# EasyEDA Pro project [Flatfish]_DevBoard.epro, schematic Schematic
Board Name: Board1; Create Date: 2025-02-04; Page Name: P1; Project Name: [Flatfish]; Schematic Name: Schematic; Update Date: 2025-02-23; Company: 嘉立创EDA; Drawed: 晚寒; Page Size: A4; Reviewed: 晚寒; Version: V1.0
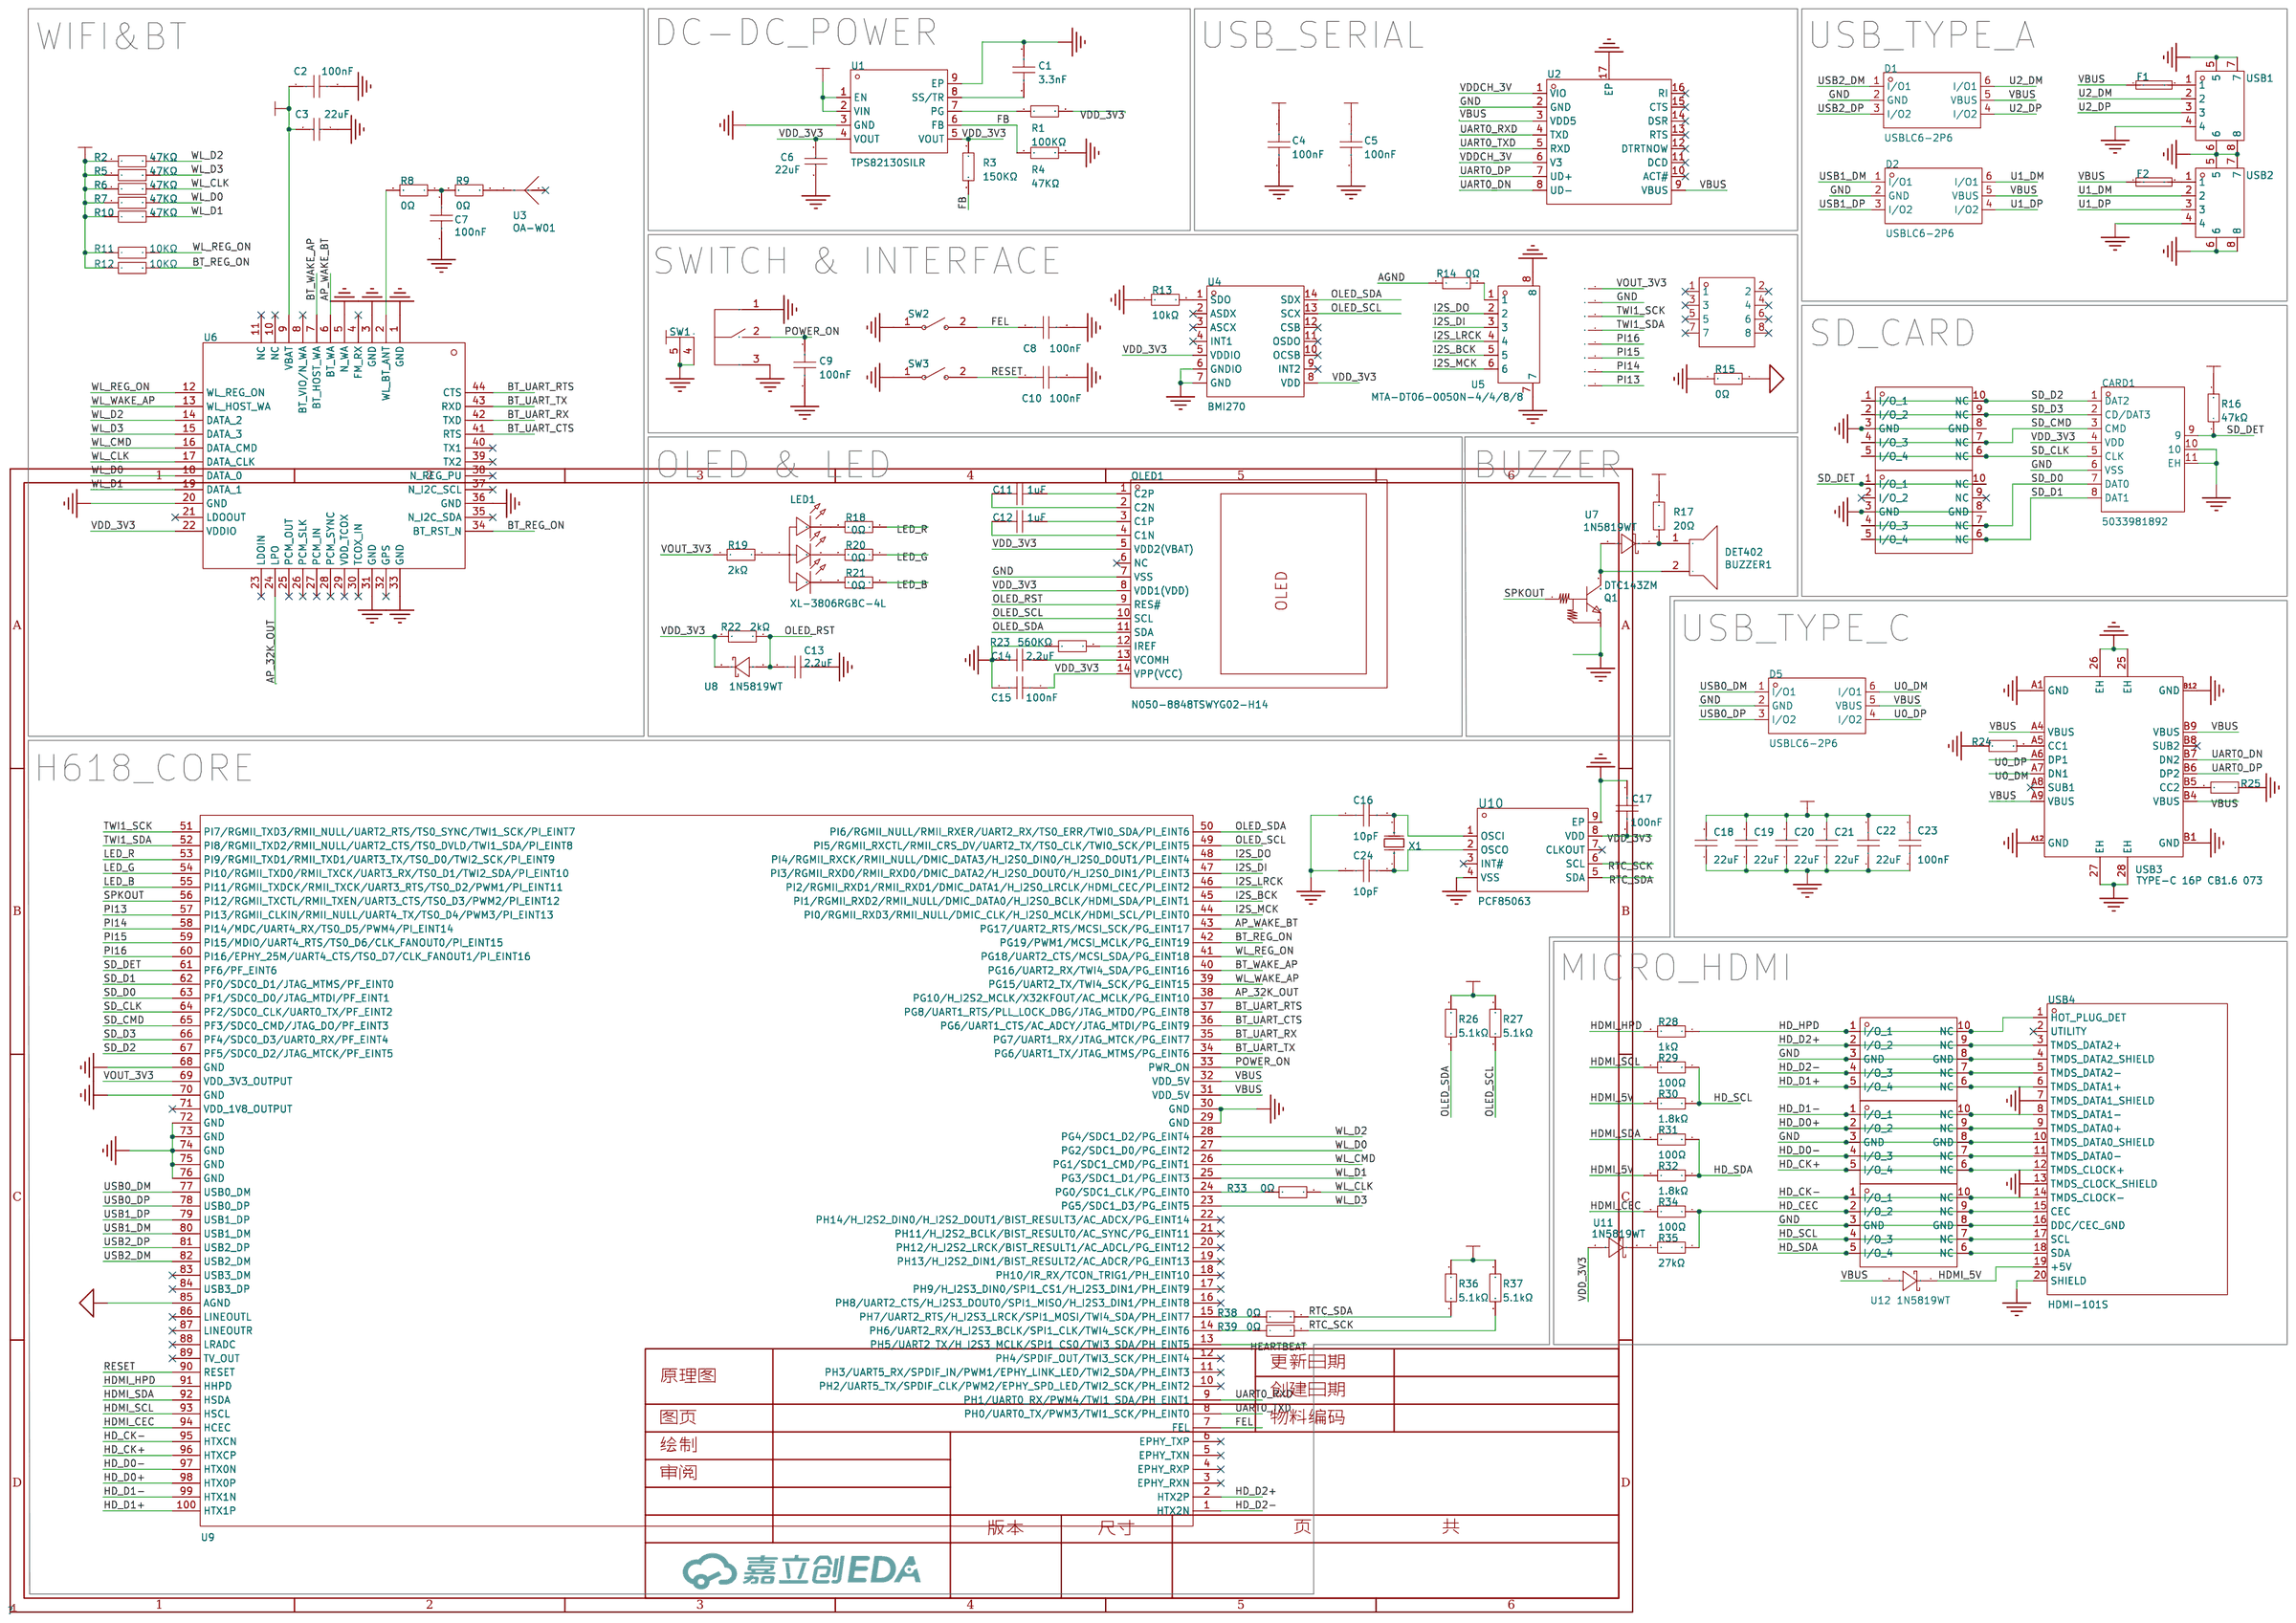
[diagram p0: schematic sheet]

## Parts
BUZZER1  DET402  [BUZ-SMD_L4.0-W3.0-LS4.5-FD]
C1  3.3nF  [C0402-NSK]
C2  100nF  [C0402-NSK]
C3  22uF  [C0603 NSK]
C4  100nF  [C0402-NSK]
C5  100nF  [C0402-NSK]
C6  22uF  [C0603 NSK]
C7  100nF  [C0402-NSK]
C8  100nF  [C0402-NSK]
C9  100nF  [C0402-NSK]
C10  100nF  [C0402-NSK]
C11  1uF  [C0402-NSK]
C12  1uF  [C0402-NSK]
C13  2.2uF  [C0402-NSK]
C14  2.2uF  [C0402-NSK]
C15  100nF  [C0402-NSK]
C16  10pF  [C0402-NSK]
C17  100nF  [C0402-NSK]
C18  22uF  [C0603 NSK]
C19  22uF  [C0603 NSK]
C20  22uF  [C0603 NSK]
C21  22uF  [C0603 NSK]
C22  22uF  [C0402-NSK]
C23  100nF  [C0402-NSK]
C24  10pF  [C0402-NSK]
CARD1  5033981892  [TF-SMD_503398-1892]
D1  USBLC6-2P6  [SOT-666-6_L1.6-W1.2-P0.50-LS1.6-BL]
D2  USBLC6-2P6  [SOT-666-6_L1.6-W1.2-P0.50-LS1.6-BL]
D3  ESD73034D  [DFN2510-10_L2.5-W1.0-P0.50-BL]
D4  ESD73034D  [DFN2510-10_L2.5-W1.0-P0.50-BL]
D5  USBLC6-2P6  [SOT-666-6_L1.6-W1.2-P0.50-LS1.6-BL]
D6  ESD73034D  [DFN2510-10_L2.5-W1.0-P0.50-BL]
D7  ESD73034D  [DFN2510-10_L2.5-W1.0-P0.50-BL]
D8  ESD73034D  [DFN2510-10_L2.5-W1.0-P0.50-BL]
F1  0603L035/16XR  [F0603]
F2  0603L035/16XR  [F0603]
H1  圆形焊盘  [圆形焊盘]
H2  B254YP-ZS04P  [HDR-TH_8P-P2.54-V-F-R2-C5-S2.54_5-534206-4]
H3  圆形焊盘  [圆形焊盘]
H4  圆形焊盘  [圆形焊盘]
H5  圆形焊盘  [圆形焊盘]
H6  圆形焊盘  [圆形焊盘]
H7  圆形焊盘  [圆形焊盘]
H8  圆形焊盘  [圆形焊盘]
H9  圆形焊盘  [圆形焊盘]
LED1  XL-3806RGBC-4L  [LED-SMD_4P-L3.8-W1.0_XL-3806RGBC-4L]
OLED1  N050-8848TSWYG02-H14  [OLED-SMD_N050-8848TSWYG02-H14]
Q1  DTC143ZM  [SOT-723-3_L1.2-W0.8-P0.80-LS1.2-BR]
R1  100KΩ  [R0402]
R2  47KΩ  [R0402]
R3  150KΩ  [R0402]
R4  47KΩ  [R0402]
R5  47KΩ  [R0402]
R6  47KΩ  [R0402]
R7  47KΩ  [R0402]
R8  0Ω  [R0402]
R9  0Ω  [R0402]
R10  47KΩ  [R0402]
R11  10KΩ  [R0402]
R12  10KΩ  [R0402]
R13  10kΩ  [R0402]
R14  0Ω  [R0402]
R15  0Ω  [R0402]
R16  47kΩ  [R0402]
R17  20Ω  [R0402]
R18  0Ω  [R0402]
R19  2kΩ  [R0402]
R20  0Ω  [R0402]
R21  0Ω  [R0402]
R22  2kΩ  [R0402]
R23  560KΩ  [R0402]
R24  5.1KΩ  [R0402]
R25  5.1KΩ  [R0402]
R26  5.1kΩ  [R0402]
R27  5.1kΩ  [R0402]
R28  1kΩ  [R0402]
R29  100Ω  [R0402]
R30  1.8kΩ  [R0402]
R31  100Ω  [R0402]
R32  1.8kΩ  [R0402]
R33  0Ω  [R0402]
R34  100Ω  [R0402]
R35  27kΩ  [R0402]
R36  5.1kΩ  [R0402]
R37  5.1kΩ  [R0402]
R38  0Ω  [R0402]
R39  0Ω  [R0402]
SW1  EVPAEBB2A  [KEY-SMD_EVPAEBB2A]
SW2  SW_3*4*2MM  [SW-SMD_L3.9-W2.9-LS4.9-L]
SW3  SW_3*4*2MM  [SW-SMD_L3.9-W2.9-LS4.9-L]
U1  TPS82130SILR  [USIP-8_L3.0-W2.8-P0.65-TL-EP]
U2  -  [QFN-16_L3.0-W3.0-P0.50-TL-EP1.9]
U3  OA-W01  [ANT-SMD_L8.0-W3.0_A]
U4  BMI270  [LGA-14_L3.0-W2.5-P0.50-BR]
U5  MTA-DT06-0050N-4/4/8/8  [FFC-SMD_6P-P0.50_FH34SRJ-6S-0.5SH]
U6  -  [AW869-A]
U7  1N5819WT  [SOD-523_L1.2-W0.8-LS1.6-RD]
U8  1N5819WT  [SOD-523_L1.2-W0.8-LS1.6-RD]
U9  -  [DS-H618-CORE]
U10  PCF85063  [VSON-8_L2.0-W3.0-P0.50-BL-EP]
U11  1N5819WT  [SOD-523_L1.2-W0.8-LS1.6-RD]
U12  1N5819WT  [SOD-523_L1.2-W0.8-LS1.6-RD]
USB1  HX 8.5 CB1.9ZB  [MICRO-USB-SMD_HX-8.5-CB1.9ZB]
USB2  HX 8.5 CB1.9ZB  [MICRO-USB-SMD_HX-8.5-CB1.9ZB]
USB3  TYPE-C 16P CB1.6 073  [USB-C-SMD_SHOU_TYPE-C-16P-CB1.6]
USB4  HDMI-101S  [HDMI-SMD_HDMI-101S]
X1  32.768kHz  [OSC-SMD_L2.0-W1.2]

## Library data of the parts
BUZZER1 = DET402: Supplier Part: C2911630; Supplier Footprint: SMD; Supplier: LCSC
C1 C2 C4 C5 C7-C10 C16 C17 C22-C24 = CC0402FRNPO9BN100: 容值:10pF;精度:±1%;额定电压:50V;材质(温度系数):NP0;; LCSC Part Name: 10pF ±1% 50V; Supplier Part: C513681; Manufacturer: YAGEO(国巨); Supplier Footprint: 0402; JLCPCB Part Class: 扩展库; Datasheet: https://atta.szlcsc.com/upload/public/pdf/source/20200415/C513681_5027FF1861A780E76D33CC24CC34CA99.pdf; Supplier: LCSC; Tolerance: ±1%; Voltage Rated: 50V; Temperature Coefficient: NP0
C3 C6 C18-C21 = CC0603JRNPO9BN120: 容值:12pF;精度:±5%;额定电压:50V;材质(温度系数):NP0;; LCSC Part Name: 12pF ±5% 50V; Supplier Part: C107034; Manufacturer: YAGEO(国巨); Supplier Footprint: 0603; JLCPCB Part Class: 扩展库; Datasheet: https://atta.szlcsc.com/upload/public/pdf/source/20170420/1492670686468.pdf; Supplier: LCSC; Tolerance: ±5%; Voltage Rated: 50V; Temperature Coefficient: NP0
C11-C15 = C0402C0G150J500NTB: 容值:15pF;精度:±5%;额定电压:50V;材质(温度系数):C0G;; LCSC Part Name: 15pF ±5% 50V; Supplier Part: C115610; Manufacturer: EYANG(宇阳科技); Supplier Footprint: 0402; JLCPCB Part Class: 扩展库; Datasheet: https://atta.szlcsc.com/upload/public/pdf/source/20170616/1497588084732.pdf; Supplier: LCSC; Tolerance: ±5%; Voltage Rated: 50V; Temperature Coefficient: C0G
CARD1 = 503398-1892: 卡连接方式:自弹式;卡类型:MicroSD卡(TF卡);连接器类型:卡座;本体最大高度:-;工作温度范围:-25℃~+85℃;; LCSC Part Name: 自弹式 MicroSD卡(TF卡) 卡座; Supplier Part: C428492; Manufacturer: MOLEX; Supplier Footprint: SMD; JLCPCB Part Class: 扩展库; Datasheet: https://atta.szlcsc.com/upload/public/pdf/source/20190912/C428492_A41EF83BB8A3DB8C0B39EF65DFC54013.pdf; Supplier: LCSC; Card Connection Mode: 自弹式; Card Type: MicroSD卡(TF卡); Connector Type: 卡座; Operating Temperature Range: -25℃~+85℃
D1 D2 D5 = USBLC6-2P6_C2827693: 极性：Unidirectional 反向关断电压（典型值）：5.25V 击穿电压（最小值）：6V 箝位电压：17V 峰值脉冲电流（10/1000us）：4A 二极管阵列 TVS USB2 二极管类型: 单向TVS 钳位电压 最大: 17V 二极管封装形式: SOT-666; Supplier: LCSC; Supplier Part: C2827693; Manufacturer: TECH PUBLIC(台舟); JLCPCB Part Class: 扩展库; LCSC Part Name: MSL=3; Supplier Footprint: SOT-666-6; Datasheet: https://atta.szlcsc.com/upload/public/pdf/source/20210810/36353A9194EA9F4E33F8AE18BE051AEA.pdf; Type: ESD
D3 D4 D6-D8 = ESD73034D: 极性:双向;反向截止电压(Vrwm):3.3V;最大钳位电压:18V;峰值脉冲电流(Ipp):3A;峰值脉冲功率(Ppp):60W;击穿电压:6V;; LCSC Part Name: ESD73034D-10/TR; Supplier Part: C7202962; Manufacturer: TECH PUBLIC(台舟); Supplier Footprint: DFN2510-10; JLCPCB Part Class: 扩展库; Datasheet: https://atta.szlcsc.com/upload/public/pdf/source/20230621/0470D2674DE9F15BF57259AF0534F99C.pdf; Supplier: LCSC; polarity: 双向; Reverse Stand-Off Voltage (Vrwm): 3.3V; Maximum Clamping Voltage: 18V; Peak Pulse Current (Ipp): 3A; Peak Pulse Power Dissipation (Ppp): 60W; Breakdown Voltage: 6V; Reverse Leakage Current (Ir): 200nA; Number of Lines: 四路; Type: ESD
F1 F2 = 0603L035/16XR: 耐压:16V;最大电流:40A;保持电流(Ih):350mA;跳闸电流:750mA;; LCSC Part Name: 16V 350mA 0603自恢复; Supplier Part: C7496628; Manufacturer: LUTE(陆特); Supplier Footprint: 0603; JLCPCB Part Class: 扩展库; Datasheet: https://atta.szlcsc.com/upload/public/pdf/source/20230807/696632CDD396EBD91087F7A9C6D2528B.pdf; Supplier: LCSC; Voltage - Max: 16V; Current - Max: 40A; Hold Current: 350mA; Trip Current: 750mA; Power Dissipation: 500mW; Resistance - Initial (Ri) (Min): 200mΩ; Resistance - Post Trip (R1) (Max): 1.4Ω; Time to Trip(Max): 100ms; Operating Temperature: -40℃~+85℃
H1 H3-H9 = 圆形焊盘: _: undefined; Supplier: 无
H2 = B254YP-ZS04P: 插孔结构:2x4P;脚间距:2.54mm;行距:2.54mm;圆孔/方孔:方孔;安装方式:直插;排数:双排;总孔位数:8P;额定电流:3A;插孔方向:顶部;塑高:8.5mm;工作温度:-40℃~+105℃;; LCSC Part Name: 排母 间距：2.54mm 2x4P 直插 方孔; Supplier Part: C41413865; Manufacturer: BXCONN(宝讯); Supplier Footprint: 插件,P=2.54mm; JLCPCB Part Class: 扩展库; Datasheet: https://atta.szlcsc.com/upload/public/pdf/source/20240923/C30EAA82432F541EFEF0DFB626076548.pdf; Supplier: LCSC; Holes Structure: 2x4P; Pitch: 2.54mm; Row Spacing: 2.54mm; Circular Hole / Square Hole: 方孔; Mounting Type: 直插; Number of Rows: 双排; Number of Positions: 8P; Current Rating: 3A; Holes Direction: 顶部; Insulation Height: 8.5mm; Operating Temperature: -40℃~+105℃
LED1 = XL-3806RGBC-4L: 020七彩四脚贴片LED灯珠 3806侧贴RGB; Supplier Part: C2843779; Manufacturer: XINGLIGHT(成兴光); Supplier Footprint: SMD,1x3.8mm; Datasheet: https://atta.szlcsc.com/upload/public/pdf/source/20240218/51067B99556A1A02DEC15823CF43ECFF.pdf; Supplier: LCSC
OLED1 = N050-8848TSWYG02-H14: 主控芯片:CH1115;尺寸(inch):0.5;; LCSC Part Name: 0.50寸 白光 88x48像素分辨率 14PIN; Supplier Part: C2890604; Manufacturer: Newvision(新智景); JLCPCB Part Class: 扩展库; Supplier: LCSC; Main Control Chip: CH1115; Size: 0.5
Q1 = DTC123YM: Supplier Part: C2991958; Manufacturer: CJ(江苏长电/长晶); Supplier Footprint: SOT-723-3; Datasheet: https://atta.szlcsc.com/upload/public/pdf/source/20220411/A4A2C6051A8C92828AF28D7E9AAF91CA.pdf; Supplier: LCSC
R1-R7 R10-R12 R14 R15 R17 R23 = 0402WGF2200TCE: 电阻类型:厚膜电阻;阻值:220Ω;精度:±1%;功率:62.5mW;温度系数:±100ppm/℃;最大工作电压:50V;工作温度范围:-55℃~+155℃;; LCSC Part Name: 220Ω ±1% 62.5mW; Supplier Part: C25091; Manufacturer: UNI-ROYAL(厚声); Supplier Footprint: 0402; JLCPCB Part Class: 基础库; Datasheet: https://atta.szlcsc.com/upload/public/pdf/source/20200306/C422600_1E6D84923E4A46A82E41ADD87F860B5C.pdf; Supplier: LCSC; Type: 厚膜电阻; Tolerance: ±1%; Power(Watts): 62.5mW; Temperature Coefficient: ±100ppm/℃; Overload Voltage (Max): 50V; Operating Temperature Range: -55℃~+155℃
R8 R9 R13 R16 R18-R22 R24-R39 = 0402WGF2402TCE: 电阻类型:厚膜电阻;阻值:24kΩ;精度:±1%;功率:62.5mW;; LCSC Part Name: 24kΩ ±1% 62.5mW; Supplier Part: C25769; Manufacturer: UNI-ROYAL(厚声); Supplier Footprint: 0402; JLCPCB Part Class: 基础库; Datasheet: https://atta.szlcsc.com/upload/public/pdf/source/20200306/C422600_1E6D84923E4A46A82E41ADD87F860B5C.pdf; Supplier: LCSC; Type: 厚膜电阻; Tolerance: ±1%; Power(Watts): 62.5mW; Temperature Coefficient: ±100ppm/℃; Overload Voltage (Max): 50V; Operating Temperature Range: -55℃~+155℃
SW1 = EVPAEBB2A: 电路结构:单刀单掷;按钮形状:矩形按钮;作用力:1.6N;安装方式:立贴;开关长度:4.5mm;开关宽度:2.6mm;开关高度:2.9mm;触点电流:20mA;额定电压(AC):-;额定电压(DC):15V;绝缘电阻:100MΩ;带灯:-;机械寿命:20万次;; LCSC Part Name: 4.5*2.6*2.9mm 立贴 轻触开关; Supplier Part: C79149; Manufacturer: PANASONIC(松下); Supplier Footprint: SMD,2.6x4.5mm; JLCPCB Part Class: 扩展库; Datasheet: https://atta.szlcsc.com/upload/public/pdf/source/20160718/1468827514287.pdf; Supplier: LCSC; Circuit: 单刀单掷; Actuator Style: 矩形按钮; Operating Force: 1.6N; Mounting Style: 立贴; Switch Length: 4.5mm; Switch Width: 2.6mm; Switch Height: 2.9mm; Contact Current: 20mA; Voltage Rating (DC): 15V; Insulation Resistance: 100MΩ; Mechanical Life: 20万次; Operating Temperature: -40℃~+85℃
SW2 SW3 = SW_3*4*2MM: Supplier Part: C9900016193; Supplier Footprint: SW_3*4*2; Supplier: LCSC
U1 = TPS82130SILR: TPS82130 TPS82130 具有集成电感的 3A 17V 降压转换器; Supplier Part: C473914; Manufacturer: TI(德州仪器); Supplier Footprint: USIP-8; JLCPCB Part Class: 扩展库; Datasheet: https://www.ti.com/cn/lit/gpn/tps82130; Supplier: LCSC
U2 = CH343P
U3 = OA-W01: Supplier Part: C9900013136; Supplier Footprint: ANT_OA-W01; JLCPCB Part Class: 扩展库; Supplier: LCSC
U4 = BMI270: 传感器类型:加速度计陀螺仪;; Supplier Part: C2836813; Manufacturer: Bosch(博世); Supplier Footprint: LGA-14(2.5x3); JLCPCB Part Class: 扩展库; Datasheet: https://atta.szlcsc.com/upload/public/pdf/source/20210625/C2836813_35E1F3F92097F45A3828DF13DDBA01A5.pdf; Supplier: LCSC; Sensor Type: 加速度计陀螺仪; Operating Temperature: -40℃~+85℃
U5 = MTA-DT06-0050N-4/4/8/8: Supplier Part: C41407921; Manufacturer: MINTRON(明硕); Supplier Footprint: P=0.5mm; Datasheet: https://atta.szlcsc.com/upload/public/pdf/source/20240914/4DC2B6334F7371956C0E6717EE373EF6.pdf; Supplier: LCSC
U6 = AW869-A
U7 U8 U11 U12 = 1N5819WT_C5185918: Supplier Part: C5185918; Manufacturer: Slkor(萨科微); Supplier Footprint: SOD-523; JLCPCB Part Class: 扩展库; Datasheet: https://atta.szlcsc.com/upload/public/pdf/source/20221009/97BA7A7C41FA3EE01B3D72EDF2EE8067.pdf; Supplier: LCSC
U9 = DS-H618核心板
U10 = PCF85063TP/1Z: Supplier Part: C126170; Manufacturer: NXP(恩智浦); Supplier Footprint: VSON-8-EP(2x3); JLCPCB Part Class: 扩展库; Datasheet: https://atta.szlcsc.com/upload/public/pdf/source/20191129/C126170_981191297460F7359CEAC0EA84BD6628.pdf; Supplier: LCSC; Supply Voltage: 900mV~5.5V; Input Low Voltage: 0V~1.65V; Intput High Voltage: 0.63V~5.5V; Output Low Voltage: 0V~1.1V; Output High Voltage: 0.72V~5.5V; Operating Temperatue: -40℃~+85℃
USB1 USB2 = HX 8.5 CB1.9ZB: 连接器类型:Type-A;标准:USB 2.0;公母:母;安装方式:沉板;触点数量:4P;端口数量:1;额定电流 - 电源:1.5A;工作温度范围:-40℃~+85℃;; Supplier Part: C19189118; Manufacturer: hanxia(韩下); Supplier Footprint: SMD; JLCPCB Part Class: 扩展库; Datasheet: https://atta.szlcsc.com/upload/public/pdf/source/20231103/D03B213206816A0CE5C9ECA2B10CD46F.pdf; Supplier: LCSC; Connector Type: Type-A; Standard: USB 2.0; Gender: 母; Mounting Style: 沉板; Number of Contacts: 4P; Number of Ports: 1; Current Rating - Power (Max): 1.5A; Operating Temperature Range: -40℃~+85℃
USB3 = TYPE-C 16P CB1.6 073: 连接器类型:Type-C;标准:-;公母:母;端口数量:1;触点数量:16P;安装方式:沉板;额定电流 - 电源:3A;工作温度范围:-25℃~+85℃;; LCSC Part Name: Type-C 母 沉板; Supplier Part: C2906290; Manufacturer: SHOU HAN(首韩); Supplier Footprint: SMD; JLCPCB Part Class: 扩展库; Datasheet: https://atta.szlcsc.com/upload/public/pdf/source/20211021/35D048B933FA988260DD32545575C1A5.pdf; Supplier: LCSC; Connector Type: Type-C; Gender: 母; Number of Ports: 1; Number of Contacts: 16P; Mounting Style: 沉板; Current Rating - Power (Max): 3A; Operating Temperature Range: -25℃~+85℃
USB4 = HDMI-101S: 连接器类型:HDMI;公母:母;总PIN位数:19P;安装方式:卧贴;排数:2;额定电流:500mA;触头材质:-;触头镀层:-;工作温度范围:-45℃~+85℃;; LCSC Part Name: HDMI 母 P数:19P; Supplier Part: C720620; Manufacturer: XUNPU(讯普); Supplier Footprint: SMD; JLCPCB Part Class: 扩展库; Datasheet: https://atta.szlcsc.com/upload/public/pdf/source/20221020/616DAE1EB19486B3E4252E4542EF441F.pdf; Supplier: LCSC; Connector Type: HDMI; Gender: 母; Number of Pins: 19P; Mounting Style: 卧贴; Number of Rows: 2; Current Rating (Max): 500mA; Operating Temperature Range: -45℃~+85℃
X1 = X201232768KJD2SI: 晶振类型:贴片晶振;频率:32.768kHz;常温频差:±20ppm;外接负载电容:7pF;频率稳定度(全温):±30ppm;; LCSC Part Name: 32.768kHz ±20ppm 7pF; Supplier Part: C383843; Manufacturer: YXC(扬兴晶振); Supplier Footprint: SMD2012-2P; Datasheet: https://atta.szlcsc.com/upload/public/pdf/source/20240329/EAF6156B280A4D2FB21BB6AE3B6FE94A.pdf; Supplier: LCSC; Crystal Type: 贴片晶振; Normal temperature Frequency Tolerance: ±20ppm; External load capacitor: 7pF; Frequency Stability(Full temperature range): ±30ppm; Operating Temperature: -40℃~+85℃

## Nets
AGND: R14.1 R15.2 U9.85(AGND)
GND: C1.1 C2.2 C3.1 C4.2 C5.2 C6.1 C7.2 C8.2 C9.2 C10.2 C13.1 C14.2 C15.2 C16.1 C17.1 C18.1 C19.1 C20.1 C21.1 C22.2 C23.2 C24.1 CARD1.6(VSS) CARD1.10 CARD1.11(EH) D1.2(GND) D2.2(GND) D3.3(GND) D3.8(GND) D4.3(GND) D4.8(GND) D5.2(GND) D6.3(GND) D6.8(GND) D7.3(GND) D7.8(GND) D8.3(GND) D8.8(GND) H3.1 OLED1.7(VSS) Q1.2(GND) R4.2 R13.1 R15.1 R23.1 R24.1 R25.2 SW1.1 SW1.3 SW1.4 SW1.5 SW2.1 SW3.1 U1.3(GND) U1.9(EP) U2.2(GND) U2.17(EP) U4.6(GNDIO) U4.7(GND) U5.7 U5.8 U6.1(GND) U6.3(GND) U6.5(N_WA) U6.20(GND) U6.31(GND) U6.33(GND) U6.36(GND) U9.29(GND) U9.30(GND) U9.68(GND) U9.70(GND) U9.72(GND) U9.73(GND) U9.74(GND) U9.75(GND) U9.76(GND) U10.4(VSS) U10.9(EP) USB1.4 USB1.5 USB1.6 USB1.7 USB1.8 USB2.4 USB2.5 USB2.6 USB2.7 USB2.8 USB3.25(EH) USB3.26(EH) USB3.27(EH) USB3.28(EH) USB3.A1(GND) USB3.A12(GND) USB3.B1(GND) USB3.B12(GND) USB4.4(TMDS_DATA2_SHIELD) USB4.7(TMDS_DATA1_SHIELD) USB4.10(TMDS_DATA0_SHIELD) USB4.13(TMDS_CLOCK_SHIELD) USB4.16(DDC/CEC_GND) USB4.20(SHIELD)
VBUS: C5.1 C18.2 C19.2 C20.2 C21.2 C22.1 C23.1 D1.5(VBUS) D2.5(VBUS) D5.5(VBUS) F1.1 F2.1 U1.1(EN) U1.2(VIN) U2.3(VDD5) U2.9(VBUS) U9.31(VDD_5V) U9.32(VDD_5V) U12.2 USB3.A4(VBUS) USB3.A9(VBUS) USB3.B4(VBUS) USB3.B9(VBUS)
VDD_3V3: C2.1 C3.2 C6.2 C15.1 C17.2 CARD1.4(VDD) OLED1.5(VDD2(VBAT)) OLED1.8(VDD1(VDD)) OLED1.14(VPP(VCC)) R1.2 R2.1 R3.1 R5.1 R6.1 R7.1 R10.1 R11.1 R12.1 R16.2 R17.2 R22.2 R26.1 R27.1 R36.1 R37.1 U1.4(VOUT) U1.5(VOUT) U4.5(VDDIO) U4.8(VDD) U6.9(VBAT) U6.22(VDDIO) U8.1 U10.8(VDD) U11.2
VDDCH_3V: C4.1 U2.1(VIO) U2.6(V3)
AP_32K_OUT: U6.24(LPO) U9.38(PG10/H_I2S2_MCLK/X32KFOUT/AC_MCLK/PG_EINT10)
AP_WAKE_BT: U6.6(BT_WA) U9.43(PG17/UART2_RTS/MCSI_SCK/PG_EINT17)
BT_REG_ON: R12.2 U6.34(BT_RST_N) U9.42(PG19/PWM1/MCSI_MCLK/PG_EINT19)
BT_UART_CTS: U6.41(RTS) U9.36(PG6/UART1_CTS/AC_ADCY/JTAG_MTDI/PG_EINT9)
BT_UART_RTS: U6.44(CTS) U9.37(PG8/UART1_RTS/PLL_LOCK_DBG/JTAG_MTDO/PG_EINT8)
BT_UART_RX: U6.42(TXD) U9.35(PG7/UART1_RX/JTAG_MTCK/PG_EINT7)
BT_UART_TX: U6.43(RXD) U9.34(PG6/UART1_TX/JTAG_MTMS/PG_EINT6)
BT_WAKE_AP: U6.7(BT_HOST_WA) U9.40(PG16/UART2_RX/TWI4_SDA/PG_EINT16)
FB: R3.2 R4.1 U1.6(FB)
FEL: C8.1 SW2.2 U9.7(FEL)
HD_CEC: D8.2(I/O) D8.9(NC) R34.1 R35.1 USB4.15(CEC)
HD_CK+: D7.5(I/O_4) D7.6(NC) U9.96(HTXCP) USB4.12(TMDS_CLOCK+)
HD_CK-: D8.1(I/O) D8.10(NC) U9.95(HTXCN) USB4.14(TMDS_CLOCK-)
HD_D0+: D7.2(I/O) D7.9(NC) U9.98(HTX0P) USB4.9(TMDS_DATA0+)
HD_D0-: D7.4(I/O_3) D7.7(NC) U9.97(HTX0N) USB4.11(TMDS_DATA0-)
HD_D1+: D6.5(I/O_4) D6.6(NC) U9.100(HTX1P) USB4.6(TMDS_DATA1+)
HD_D1-: D7.1(I/O) D7.10(NC) U9.99(HTX1N) USB4.8(TMDS_DATA1-)
HD_D2+: D6.2(I/O) D6.9(NC) U9.2(HTX2P) USB4.3(TMDS_DATA2+)
HD_D2-: D6.4(I/O_3) D6.7(NC) U9.1(HTX2N) USB4.5(TMDS_DATA2-)
HD_HPD: D6.1(I/O) D6.10(NC) R28.1 USB4.1(HOT_PLUG_DET)
HD_SCL: D8.4(I/O_3) D8.7(NC) R29.1 R30.1 USB4.17(SCL)
HD_SDA: D8.5(I/O_4) D8.6(NC) R31.1 R32.1 USB4.18(SDA)
HDMI_5V: R30.2 R32.2 U12.1 USB4.19(+5V)
HDMI_CEC: R34.2 U9.94(HCEC)
HDMI_HPD: R28.2 U9.91(HHPD)
HDMI_SCL: R29.2 U9.93(HSCL)
HDMI_SDA: R31.2 U9.92(HSDA)
HEARTBEAT: U9.13(PH5/UART2_TX/H_I2S3_MCLK/SPI1_CS0/TWI3_SDA/PH_EINT5)
I2S_BCK: U5.5 U9.45(PI1/RGMII_RXD2/RMII_NULL/DMIC_DATA0/H_I2S0_BCLK/HDMI_SDA/PI_EINT1)
I2S_DI: U5.3 U9.47(PI3/RGMII_RXD0/RMII_RXD0/DMIC_DATA2/H_I2S0_DOUT0/H_I2S0_DIN1/PI_EINT3)
I2S_DO: U5.2 U9.48(PI4/RGMII_RXCK/RMII_NULL/DMIC_DATA3/H_I2S0_DIN0/H_I2S0_DOUT1/PI_EINT4)
I2S_LRCK: U5.4 U9.46(PI2/RGMII_RXD1/RMII_RXD1/DMIC_DATA1/H_I2S0_LRCLK/HDMI_CEC/PI_EINT2)
I2S_MCK: U5.6 U9.44(PI0/RGMII_RXD3/RMII_NULL/DMIC_CLK/H_I2S0_MCLK/HDMI_SCL/PI_EINT0)
LED_B: R21.1 U9.55(PI11/RGMII_TXDCK/RMII_TXCK/UART3_RTS/TS0_D2/PWM1/PI_EINT11)
LED_G: R20.1 U9.54(PI10/RGMII_TXD0/RMII_TXCK/UART3_RX/TS0_D1/TWI2_SDA/PI_EINT10)
LED_R: R18.1 U9.53(PI9/RGMII_TXD1/RMII_TXD1/UART3_TX/TS0_D0/TWI2_SCK/PI_EINT9)
OLED_RST: C13.2 OLED1.9(RES#) R22.1 U8.2
OLED_SCL: OLED1.10(SCL) R27.2 U4.13(SCX) U9.49(PI5/RGMII_RXCTL/RMII_CRS_DV/UART2_TX/TS0_CLK/TWI0_SCK/PI_EINT5)
OLED_SDA: OLED1.11(SDA) R26.2 U4.14(SDX) U9.50(PI6/RGMII_NULL/RMII_RXER/UART2_RX/TS0_ERR/TWI0_SDA/PI_EINT6)
PI13: H9.1 U9.57(PI13/RGMII_CLKIN/RMII_NULL/UART4_TX/TS0_D4/PWM3/PI_EINT13)
PI14: H8.1 U9.58(PI14/MDC/UART4_RX/TS0_D5/PWM4/PI_EINT14)
PI15: H7.1 U9.59(PI15/MDIO/UART4_RTS/TS0_D6/CLK_FANOUT0/PI_EINT15)
PI16: H6.1 U9.60(PI16/EPHY_25M/UART4_CTS/TS0_D7/CLK_FANOUT1/PI_EINT16)
POWER_ON: C9.1 SW1.2 U9.33(PWR_ON)
RESET: C10.1 SW3.2 U9.90(RESET)
RTC_SCK: R37.2 R39.2 U10.6(SCL)
RTC_SDA: R36.2 R38.2 U10.5(SDA)
SD_CLK: CARD1.5(CLK) D3.5(I/O_4) D3.6(NC) U9.64(PF2/SDC0_CLK/UART0_TX/PF_EINT2)
SD_CMD: CARD1.3(CMD) D3.4(I/O_3) D3.7(NC) U9.65(PF3/SDC0_CMD/JTAG_DO/PF_EINT3)
SD_D0: CARD1.7(DAT0) D4.4(I/O_3) D4.7(NC) U9.63(PF1/SDC0_D0/JTAG_MTDI/PF_EINT1)
SD_D1: CARD1.8(DAT1) D4.5(I/O_4) D4.6(NC) U9.62(PF0/SDC0_D1/JTAG_MTMS/PF_EINT0)
SD_D2: CARD1.1(DAT2) D3.1(I/O) D3.10(NC) U9.67(PF5/SDC0_D2/JTAG_MTCK/PF_EINT5)
SD_D3: CARD1.2(CD/DAT3) D3.2(I/O) D3.9(NC) U9.66(PF4/SDC0_D3/UART0_RX/PF_EINT4)
SD_DET: CARD1.9 D4.1(I/O) D4.10(NC) R16.1 U9.61(PF6/PF_EINT6)
SPKOUT: Q1.1(IN) U9.56(PI12/RGMII_TXCTL/RMII_TXEN/UART3_CTS/TS0_D3/PWM2/PI_EINT12)
TWI1_SCK: H4.1 U9.51(PI7/RGMII_TXD3/RMII_NULL/UART2_RTS/TS0_SYNC/TWI1_SCK/PI_EINT7)
TWI1_SDA: H5.1 U9.52(PI8/RGMII_TXD2/RMII_NULL/UART2_CTS/TS0_DVLD/TWI1_SDA/PI_EINT8)
U0_DM: D5.6(I/O1) USB3.A7(DN1)
U0_DP: D5.4(I/O2) USB3.A6(DP1)
U1_DM: D2.6(I/O1) USB2.2
U1_DP: D2.4(I/O2) USB2.3
U2_DM: D1.6(I/O1) USB1.2
U2_DP: D1.4(I/O2) USB1.3
UART0_DN: U2.8(UD-) USB3.B7(DN2)
UART0_DP: U2.7(UD+) USB3.B6(DP2)
UART0_RXD: U2.4(TXD) U9.9(PH1/UART0_RX/PWM4/TWI1_SDA/PH_EINT1)
UART0_TXD: U2.5(RXD) U9.8(PH0/UART0_TX/PWM3/TWI1_SCK/PH_EINT0)
USB0_DM: D5.1(I/O1) U9.77(USB0_DM)
USB0_DP: D5.3(I/O2) U9.78(USB0_DP)
USB1_DM: D2.1(I/O1) U9.80(USB1_DM)
USB1_DP: D2.3(I/O2) U9.79(USB1_DP)
USB2_DM: D1.1(I/O1) U9.82(USB2_DM)
USB2_DP: D1.3(I/O2) U9.81(USB2_DP)
VOUT_3V3: H1.1 R19.2 U9.69(VDD_3V3_OUTPUT)
WL_CLK: R6.2 R33.2 U6.17(DATA_CLK)
WL_CMD: U6.16(DATA_CMD) U9.26(PG1/SDC1_CMD/PG_EINT1)
WL_D0: R7.2 U6.18(DATA_0) U9.27(PG2/SDC1_D0/PG_EINT2)
WL_D1: R10.2 U6.19(DATA_1) U9.25(PG3/SDC1_D1/PG_EINT3)
WL_D2: R2.2 U6.14(DATA_2) U9.28(PG4/SDC1_D2/PG_EINT4)
WL_D3: R5.2 U6.15(DATA_3) U9.23(PG5/SDC1_D3/PG_EINT5)
WL_REG_ON: R11.2 U6.12(WL_REG_ON) U9.41(PG18/UART2_CTS/MCSI_SDA/PG_EINT18)
WL_WAKE_AP: U6.13(WL_HOST_WA) U9.39(PG15/UART2_TX/TWI4_SCK/PG_EINT15)
$F1_2: F1.2 USB1.1
$F2_2: F2.2 USB2.1
Net-(BUZZER1-1): BUZZER1.1(+) R17.1 U7.1
Net-(BUZZER1-2): BUZZER1.2(-) Q1.3(OUT) U7.2
Net-(C1-2): C1.2 U1.8(SS/TR)
Net-(C7-1): C7.1 R8.1 R9.2
Net-(C11-1): C11.1 OLED1.2(C2N)
Net-(C11-2): C11.2 OLED1.1(C2P)
Net-(C12-1): C12.1 OLED1.3(C1P)
Net-(C12-2): C12.2 OLED1.4(C1N)
Net-(C14-1): C14.1 OLED1.13(VCOMH)
Net-(C16-2): C16.2 U10.1(OSCI) X1.2(OSC2)
Net-(C24-2): C24.2 U10.2(OSCO) X1.1(OSC1)
Net-(LED1-1): LED1.1(R-) R18.2
Net-(LED1-2): LED1.2(+) R19.1
Net-(LED1-3): LED1.3(G-) R20.2
Net-(LED1-4): LED1.4(B-) R21.2
Net-(OLED1-12): OLED1.12(IREF) R23.2
Net-(R1-1): R1.1 U1.7(PG)
Net-(R8-2): R8.2 U6.2(WL_BT_ANT)
Net-(R9-1): R9.1 U3.1(ANT)
Net-(R13-2): R13.2 U4.1(SDO)
Net-(R14-2): R14.2 U5.1
Net-(R24-2): R24.2 USB3.A5(CC1)
Net-(R25-1): R25.1 USB3.B5(CC2)
Net-(R33-1): R33.1 U9.24(PG0/SDC1_CLK/PG_EINT0)
Net-(R35-2): R35.2 U11.1
Net-(R38-1): R38.1 U9.15(PH7/UART2_RTS/H_I2S3_LRCK/SPI1_MOSI/TWI4_SDA/PH_EINT7)
Net-(R39-1): R39.1 U9.14(PH6/UART2_RX/H_I2S3_BCLK/SPI1_CLK/TWI4_SCK/PH_EINT6)

Not connected (* = marked no-connect by the designer): D4 2(I/O)* 9(NC)*; H2 1* 2* 3* 4* 5* 6* 7* 8*; OLED1 6(NC)*; U2 10(ACT#)* 11(DCD)* 12(DTRTNOW)* 13(RTS)* 14(DSR)* 15(CTS)* 16(RI)*; U3 2*; U4 2(ASDX)* 3(ASCX)* 4(INT1)* 9(INT2)* 10(OCSB)* 11(OSDO)* 12(CSB)*; U6 4(FM_RX)* 8(BT_VIO/N_WA)* 10(NC)* 11(NC)* 21(LDOOUT)* 23(LDOIN)* 25(PCM_OUT)* 26(PCM_SLK)* 27(PCM_IN)* 28(PCM_SYNC)* 29(VDD_TCOX)* 30(TCOX_IN)* 32(GPS)* 35(N_I2C_SDA)* 37(N_I2C_SCL)* 38(N_REG_PU)* 39(TX2)* 40(TX1)*; U9 3(EPHY_RXN)* 4(EPHY_RXP)* 5(EPHY_TXN)* 6(EPHY_TXP)* 10(PH2/UART5_TX/SPDIF_CLK/PWM2/EPHY_SPD_LED/TWI2_SCK/PH_EINT2)* 11(PH3/UART5_RX/SPDIF_IN/PWM1/EPHY_LINK_LED/TWI2_SDA/PH_EINT3)* 12(PH4/SPDIF_OUT/TWI3_SCK/PH_EINT4)* 16(PH8/UART2_CTS/H_I2S3_DOUT0/SPI1_MISO/H_I2S3_DIN1/PH_EINT8)* 17(PH9/H_I2S3_DIN0/SPI1_CS1/H_I2S3_DIN1/PH_EINT9)* 18(PH10/IR_RX/TCON_TRIG1/PH_EINT10)* 19(PH13/H_I2S2_DIN1/BIST_RESULT2/AC_ADCR/PG_EINT13)* 20(PH12/H_I2S2_LRCK/BIST_RESULT1/AC_ADCL/PG_EINT12)* 21(PH11/H_I2S2_BCLK/BIST_RESULT0/AC_SYNC/PG_EINT11)* 22(PH14/H_I2S2_DIN0/H_I2S2_DOUT1/BIST_RESULT3/AC_ADCX/PG_EINT14)* 71(VDD_1V8_OUTPUT)* 83(USB3_DM)* 84(USB3_DP)* 86(LINEOUTL)* 87(LINEOUTR)* 88(LRADC)* 89(TV_OUT)*; U10 3(INT#)* 7(CLKOUT)*; USB3 A8(SUB1)* B8(SUB2)*; USB4 2(UTILITY)*

## Notes on the sheet
- DC-DC_POWER
- USB_SERIAL
- USB_TYPE_A
- WIFI&BT
- SWITCH & INTERFACE
- SD_CARD
- OLED & LED
- BUZZER
- USB_TYPE_C
- H618_CORE
- MICRO_HDMI
